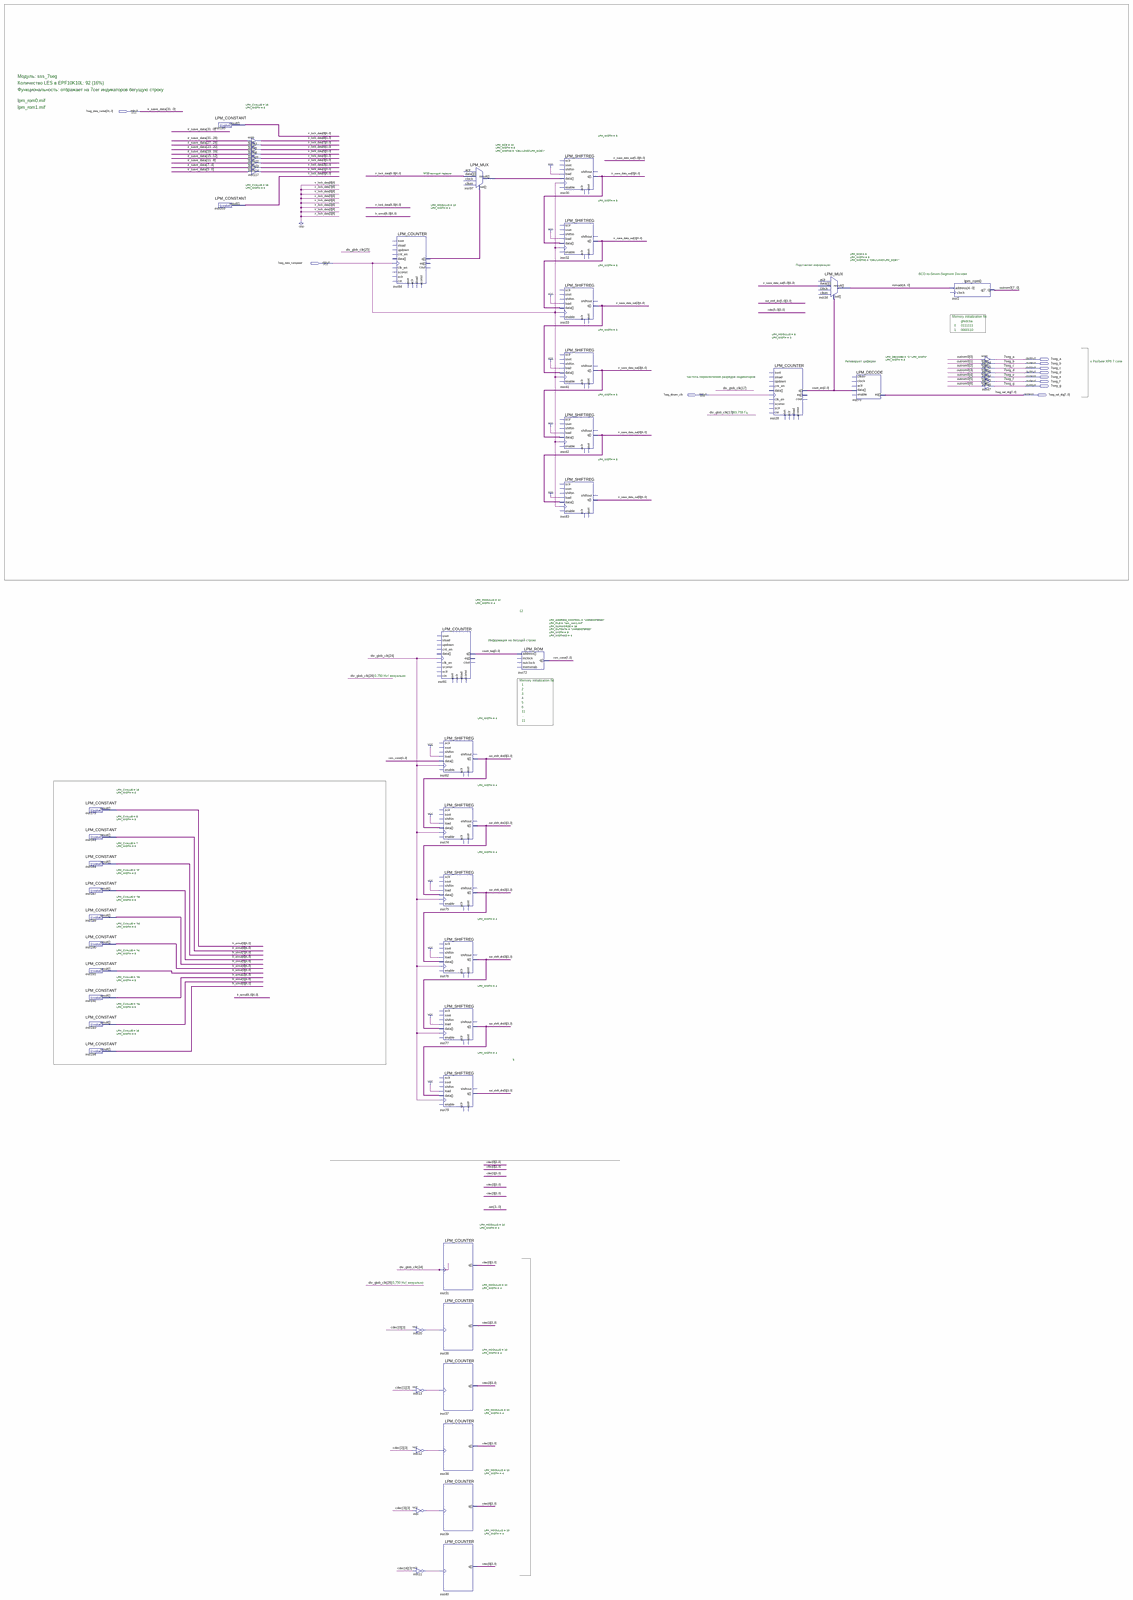
[diagram p0: schematic sheet, whole]
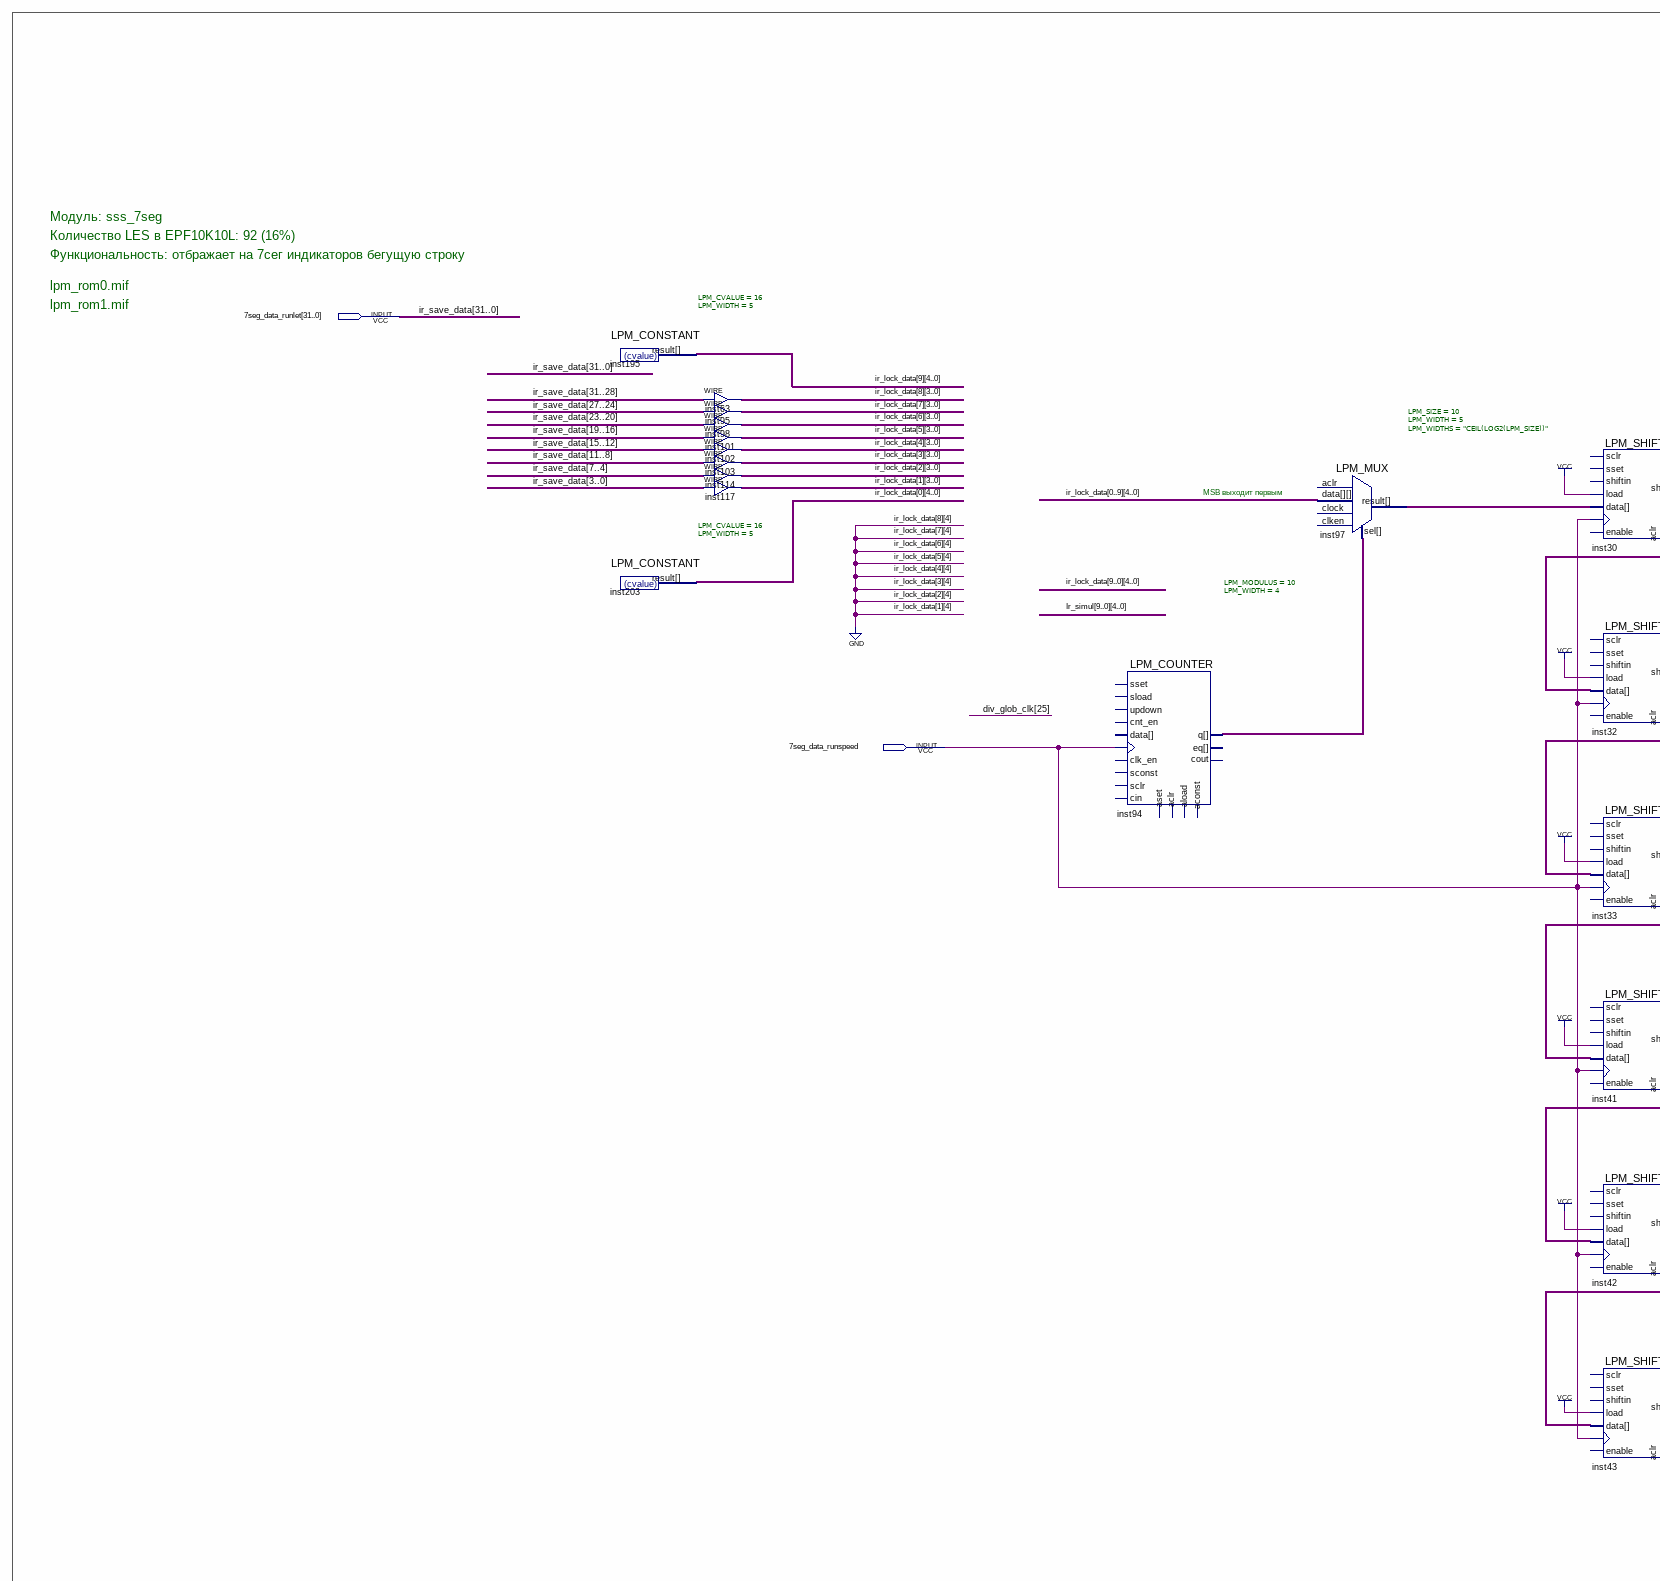
[diagram p1: schematic sheet, upper left part]
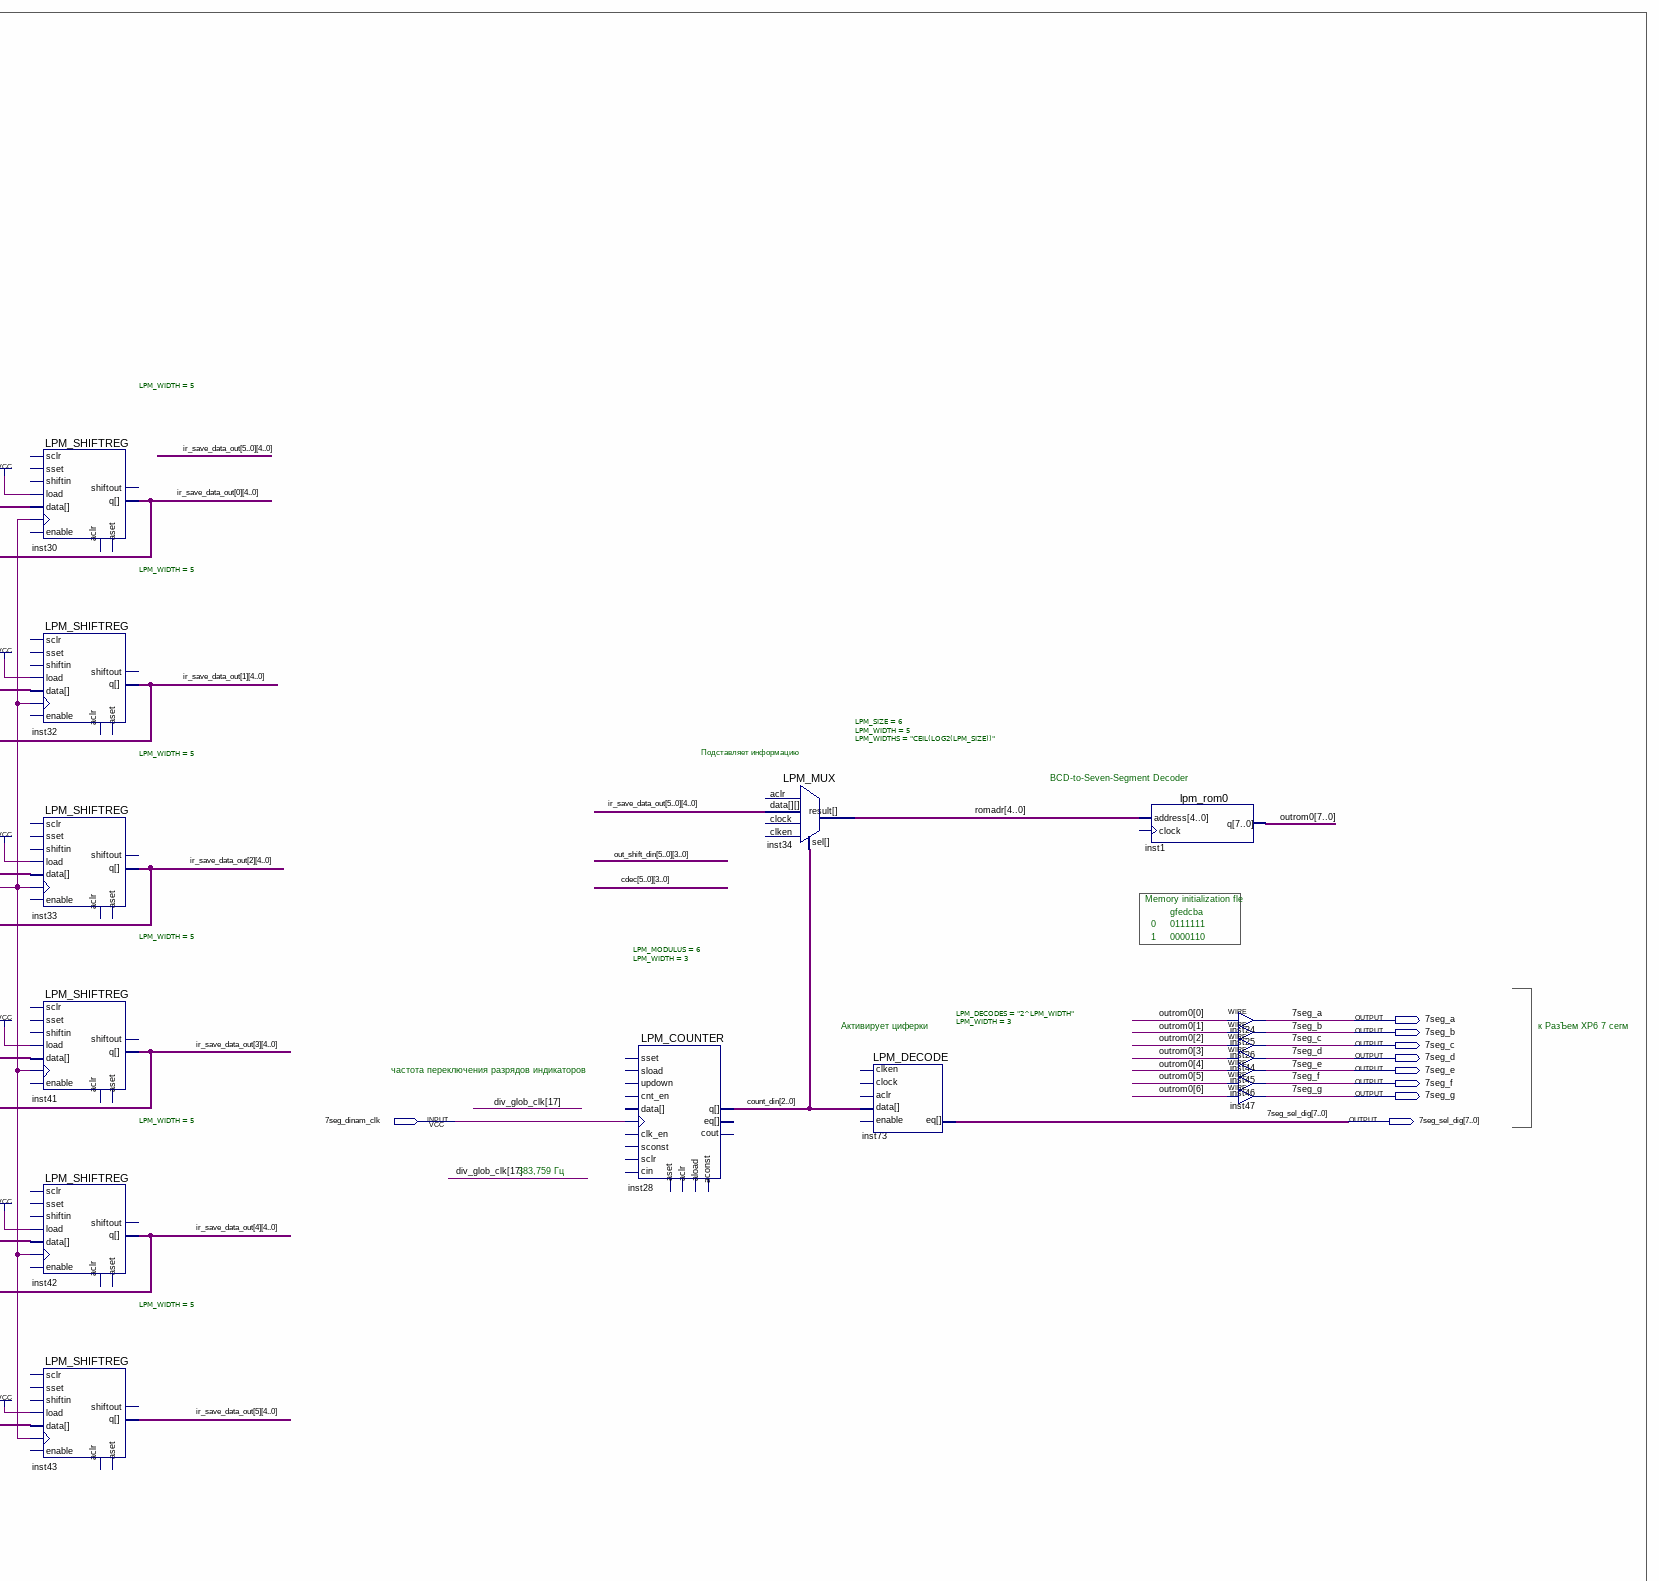
[diagram p2: schematic sheet, upper right part]
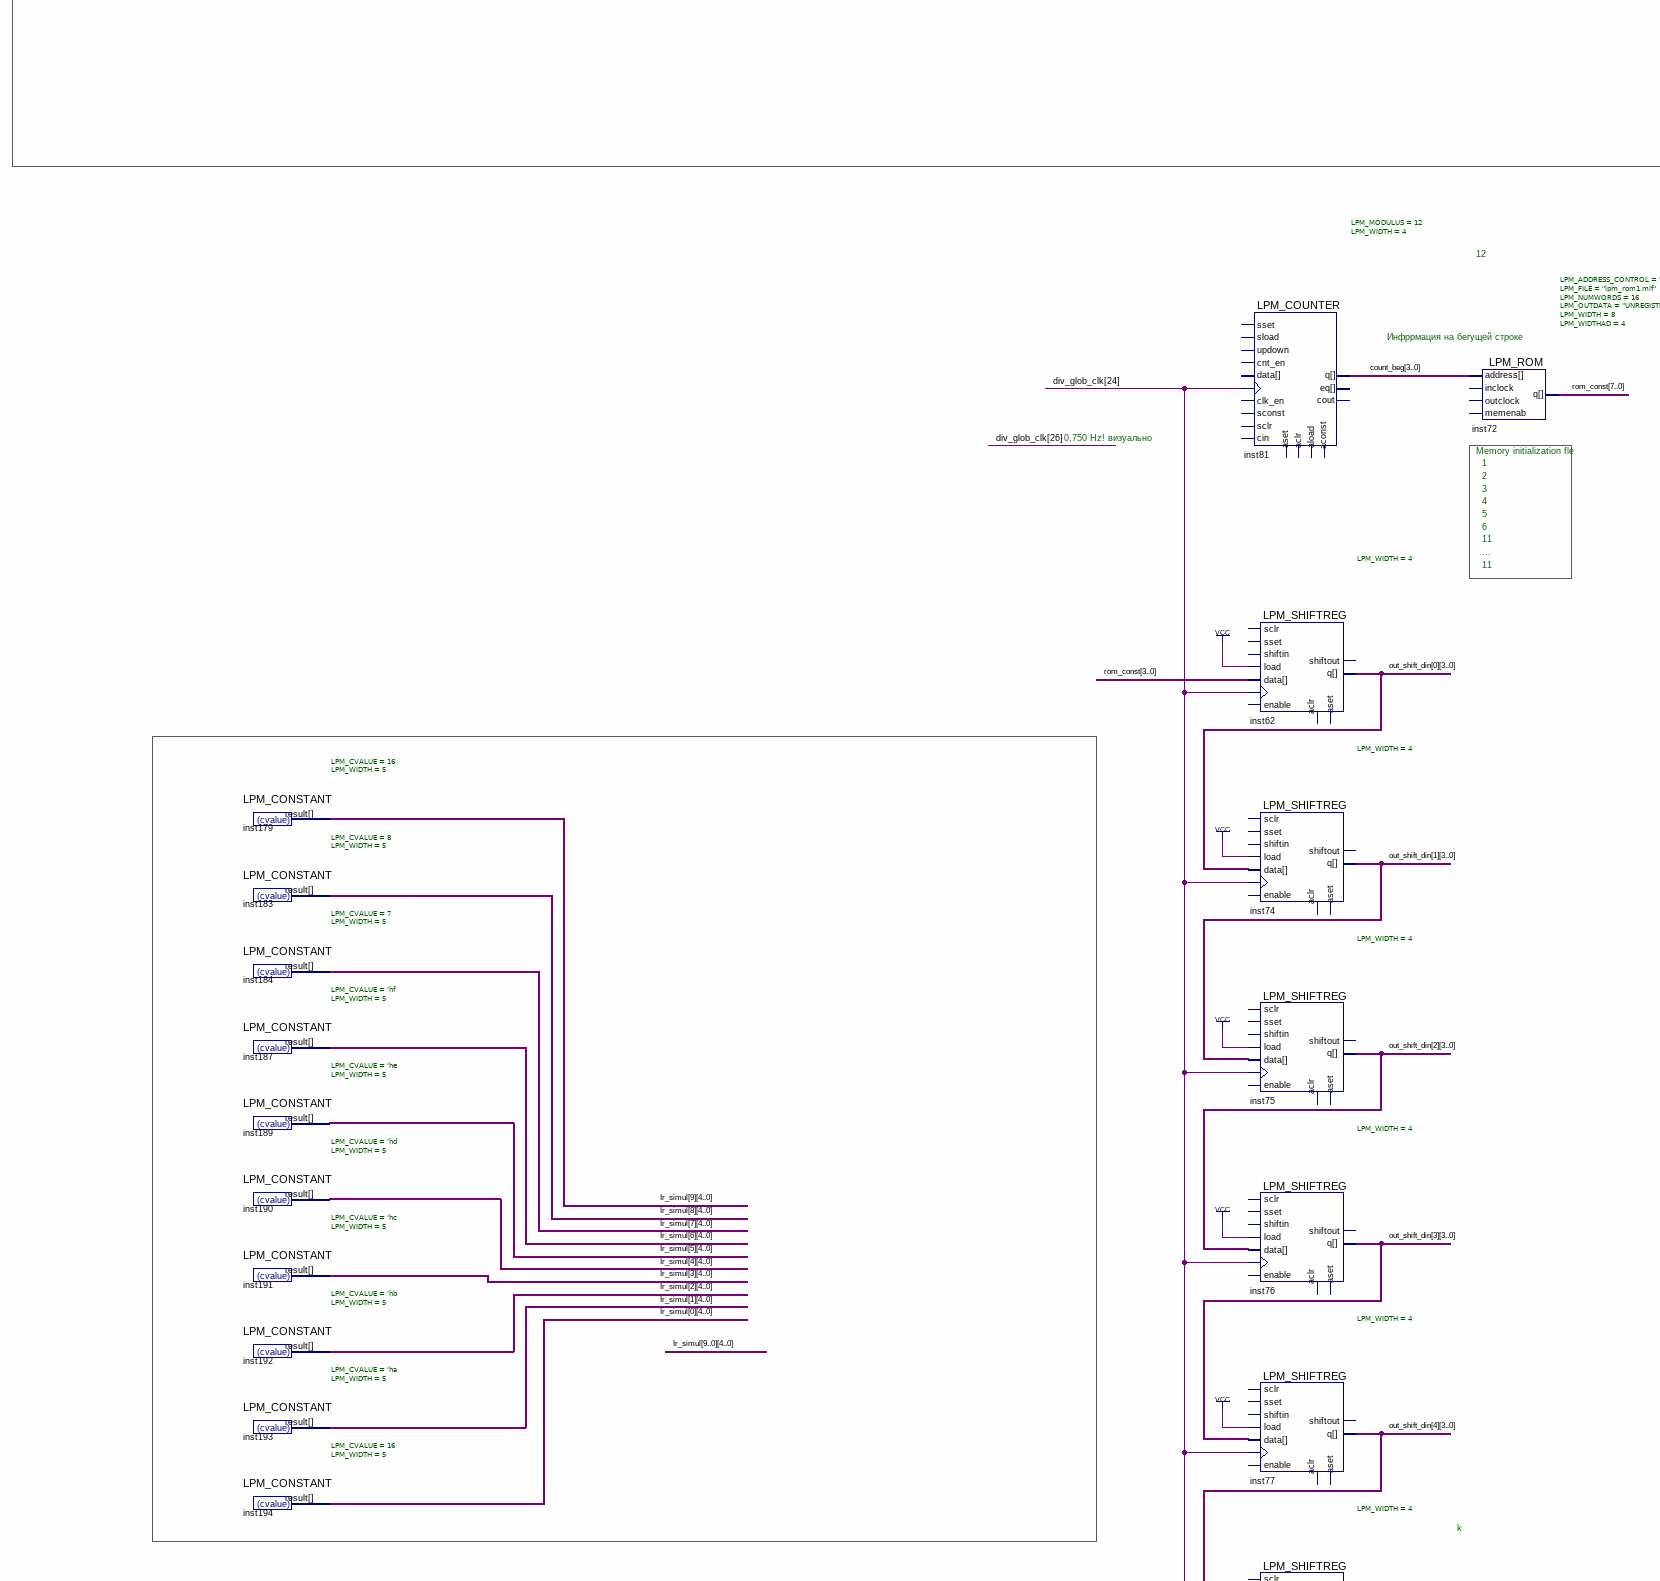
[diagram p3: schematic sheet, middle left part]
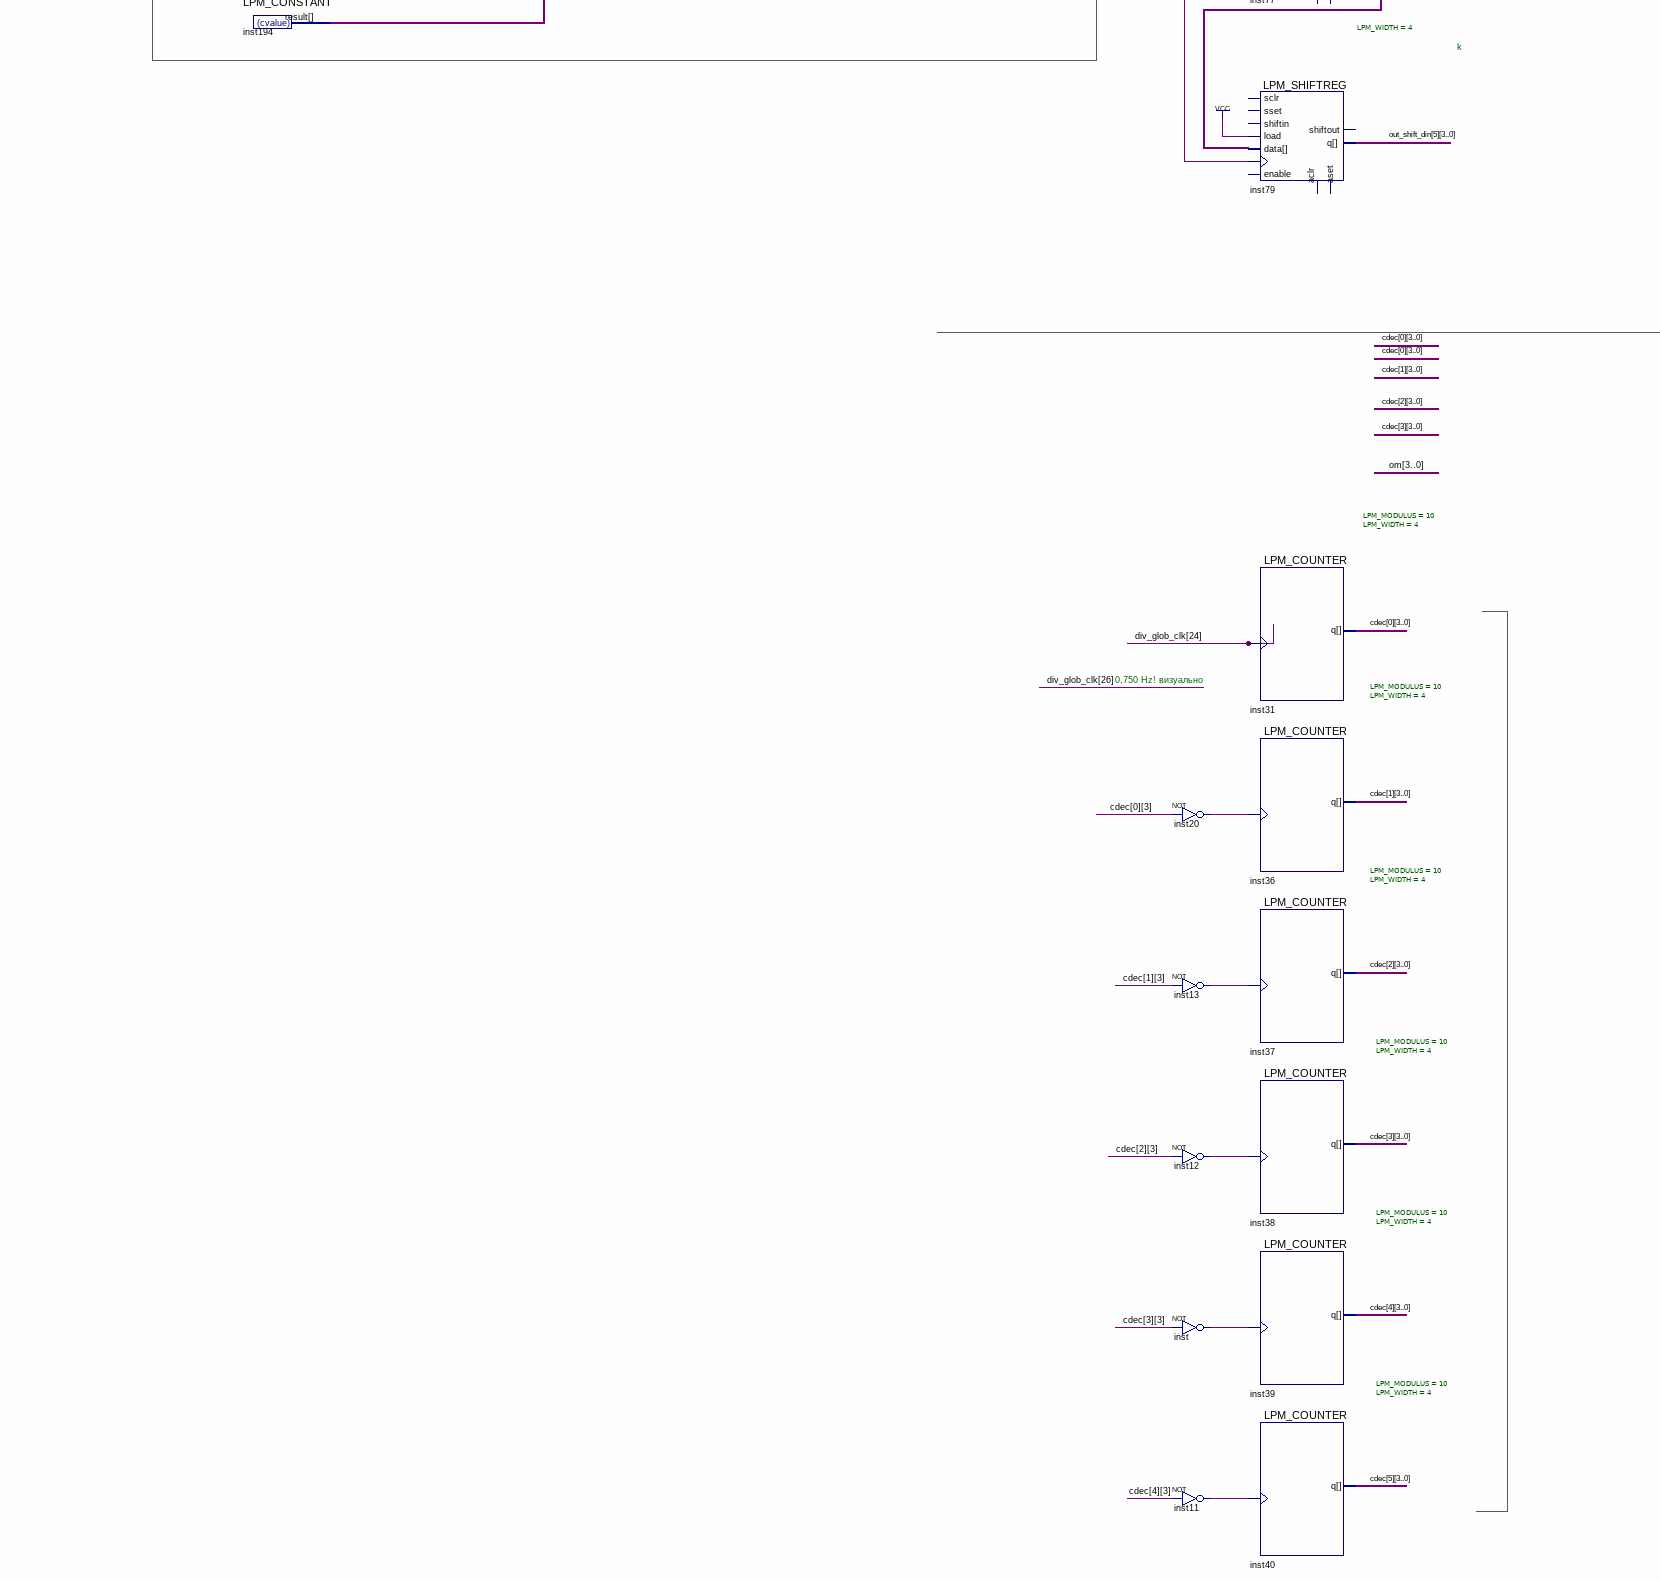
[diagram p4: schematic sheet, lower left part]
// Quartus schematic sss_7seg - Copy.bdf as structural Verilog: 58 symbols, 11 pins
module \sss_7seg_-_Copy  (
  input  [31:0] \7seg_data_runlet ,
  input  \7seg_data_runspeed ,
  input  \7seg_dinam_clk ,
  output \7seg_a ,
  output \7seg_b ,
  output \7seg_c ,
  output \7seg_d ,
  output \7seg_e ,
  output \7seg_f ,
  output \7seg_g ,
  output [7:0] \7seg_sel_dig 
);

  wire inst11_out, inst12_out, inst13_out, inst20_out, inst_out;
  wire [2:0] count_din;
  wire [3:0] cdec_0, cdec_1, cdec_2, cdec_3, cdec_4, cdec_5, count_beg, inst94_q, ir_lock_data_1,
       ir_lock_data_2, ir_lock_data_3, ir_lock_data_4, ir_lock_data_5, ir_lock_data_6, ir_lock_data_7,
       ir_lock_data_8, out_shift_din_0, out_shift_din_1, out_shift_din_2, out_shift_din_3, out_shift_din_4,
       out_shift_din_5;
  wire [4:0] inst97_result, ir_lock_data_0, ir_lock_data_9, ir_save_data_out_0, ir_save_data_out_1,
       ir_save_data_out_2, ir_save_data_out_3, ir_save_data_out_4, ir_save_data_out_5, Ir_simul_0,
       Ir_simul_1, Ir_simul_2, Ir_simul_3, Ir_simul_4, Ir_simul_5, Ir_simul_6, Ir_simul_7, Ir_simul_8,
       Ir_simul_9, romadr;
  wire [7:0] outrom0, rom_const;
  wire [24:24] div_glob_clk;

  LPM_CONSTANT #(.LPM_CVALUE(16), .LPM_WIDTH(5)) inst179 (.result(Ir_simul_9));
  LPM_CONSTANT #(.LPM_CVALUE(8), .LPM_WIDTH(5)) inst183 (.result(Ir_simul_8));
  LPM_CONSTANT #(.LPM_CVALUE(7), .LPM_WIDTH(5)) inst184 (.result(Ir_simul_7));
  LPM_CONSTANT #(.LPM_CVALUE('hf), .LPM_WIDTH(5)) inst187 (.result(Ir_simul_6));
  LPM_CONSTANT #(.LPM_CVALUE('he), .LPM_WIDTH(5)) inst189 (.result(Ir_simul_5));
  LPM_CONSTANT #(.LPM_CVALUE('hd), .LPM_WIDTH(5)) inst190 (.result(Ir_simul_4));
  LPM_CONSTANT #(.LPM_CVALUE('hc), .LPM_WIDTH(5)) inst191 (.result(Ir_simul_3));
  LPM_CONSTANT #(.LPM_CVALUE('hb), .LPM_WIDTH(5)) inst192 (.result(Ir_simul_2));
  LPM_CONSTANT #(.LPM_CVALUE('ha), .LPM_WIDTH(5)) inst193 (.result(Ir_simul_1));
  LPM_CONSTANT #(.LPM_CVALUE(16), .LPM_WIDTH(5)) inst194 (.result(Ir_simul_0));
  LPM_CONSTANT #(.LPM_CVALUE(16), .LPM_WIDTH(5)) inst195 (.result(ir_lock_data_9));
  LPM_CONSTANT #(.LPM_CVALUE(16), .LPM_WIDTH(5)) inst203 (.result(ir_lock_data_0));
  assign ir_lock_data_8 = \7seg_data_runlet [31:28];  // WIRE inst63
  assign ir_lock_data_7 = \7seg_data_runlet [27:24];  // WIRE inst95
  assign ir_lock_data_6 = \7seg_data_runlet [23:20];  // WIRE inst98
  assign ir_lock_data_5 = \7seg_data_runlet [19:16];  // WIRE inst101
  assign ir_lock_data_4 = \7seg_data_runlet [15:12];  // WIRE inst102
  assign ir_lock_data_3 = \7seg_data_runlet [11:8];  // WIRE inst103
  assign ir_lock_data_2 = \7seg_data_runlet [7:4];  // WIRE inst114
  assign ir_lock_data_1 = \7seg_data_runlet [3:0];  // WIRE inst117
  LPM_COUNTER #(.LPM_MODULUS(10), .LPM_WIDTH(4)) inst94 (
    .clock(\7seg_data_runspeed ), .q(inst94_q));  // open: sset, sload, updown, cnt_en, data, clk_en, sconst, sclr, aload, aclr, aset, aconst, cin, eq, cout
  not inst20 (inst20_out, cdec_0[3]);
  not inst13 (inst13_out, cdec_1[3]);
  not inst12 (inst12_out, cdec_2[3]);
  not inst (inst_out, cdec_3[3]);
  not inst11 (inst11_out, cdec_4[3]);
  LPM_COUNTER #(.LPM_MODULUS(12), .LPM_WIDTH(4)) inst81 (
    .clock(div_glob_clk[24]), .q(count_beg));  // open: sset, sload, updown, cnt_en, data, clk_en, sconst, sclr, aload, aclr, aset, aconst, cin, eq, cout
  LPM_SHIFTREG #(.LPM_WIDTH(4)) inst62 (
    .clock(div_glob_clk[24]), .data(rom_const[3:0]), .load(1'b1), .q(out_shift_din_0));  // open: shiftin, sset, enable, sclr, aset, aclr, shiftout
  LPM_SHIFTREG #(.LPM_WIDTH(4)) inst74 (
    .clock(div_glob_clk[24]), .data(out_shift_din_0), .load(1'b1), .q(out_shift_din_1));  // open: shiftin, sset, enable, sclr, aset, aclr, shiftout
  LPM_SHIFTREG #(.LPM_WIDTH(4)) inst75 (
    .clock(div_glob_clk[24]), .data(out_shift_din_1), .load(1'b1), .q(out_shift_din_2));  // open: shiftin, sset, enable, sclr, aset, aclr, shiftout
  LPM_SHIFTREG #(.LPM_WIDTH(4)) inst76 (
    .clock(div_glob_clk[24]), .data(out_shift_din_2), .load(1'b1), .q(out_shift_din_3));  // open: shiftin, sset, enable, sclr, aset, aclr, shiftout
  LPM_SHIFTREG #(.LPM_WIDTH(4)) inst77 (
    .clock(div_glob_clk[24]), .data(out_shift_din_3), .load(1'b1), .q(out_shift_din_4));  // open: shiftin, sset, enable, sclr, aset, aclr, shiftout
  LPM_SHIFTREG #(.LPM_WIDTH(4)) inst79 (
    .clock(div_glob_clk[24]), .data(out_shift_din_4), .load(1'b1), .q(out_shift_din_5));  // open: shiftin, sset, enable, sclr, aset, aclr, shiftout
  LPM_COUNTER #(.LPM_MODULUS(10), .LPM_WIDTH(4)) inst31 (.clock(div_glob_clk[24]), .q(cdec_0));
  LPM_COUNTER #(.LPM_MODULUS(10), .LPM_WIDTH(4)) inst36 (.clock(inst20_out), .q(cdec_1));
  LPM_COUNTER #(.LPM_MODULUS(10), .LPM_WIDTH(4)) inst37 (.clock(inst13_out), .q(cdec_2));
  LPM_COUNTER #(.LPM_MODULUS(10), .LPM_WIDTH(4)) inst38 (.clock(inst12_out), .q(cdec_3));
  LPM_COUNTER #(.LPM_MODULUS(10), .LPM_WIDTH(4)) inst39 (.clock(inst_out), .q(cdec_4));
  LPM_COUNTER #(.LPM_MODULUS(10), .LPM_WIDTH(4)) inst40 (.clock(inst11_out), .q(cdec_5));
  LPM_MUX #(.LPM_SIZE(10), .LPM_WIDTH(5), .LPM_WIDTHS("CEIL(LOG2(LPM_SIZE))")) inst97 (
    .data({ir_lock_data_0, 1'b0, ir_lock_data_1, 1'b0, ir_lock_data_2, 1'b0, ir_lock_data_3, 1'b0, ir_lock_data_4, 1'b0, ir_lock_data_5, 1'b0, ir_lock_data_6, 1'b0, ir_lock_data_7, 1'b0, ir_lock_data_8, ir_lock_data_9}),
    .sel(inst94_q), .result(inst97_result));  // open: clock, aclr, clken
  LPM_ROM #(.LPM_ADDRESS_CONTROL("UNREGISTERED"), .LPM_FILE("lpm_rom1.mif"), .LPM_NUMWORDS(16), .LPM_OUTDATA("UNREGISTERED"), .LPM_WIDTH(8), .LPM_WIDTHAD(4)) inst72 (
    .address(count_beg), .q(rom_const));  // open: inclock, outclock, memenab
  LPM_SHIFTREG #(.LPM_WIDTH(5)) inst30 (
    .clock(\7seg_data_runspeed ), .data(inst97_result), .load(1'b1), .q(ir_save_data_out_0));  // open: shiftin, sset, enable, sclr, aset, aclr, shiftout
  LPM_SHIFTREG #(.LPM_WIDTH(5)) inst32 (
    .clock(\7seg_data_runspeed ), .data(ir_save_data_out_0), .load(1'b1), .q(ir_save_data_out_1));  // open: shiftin, sset, enable, sclr, aset, aclr, shiftout
  LPM_SHIFTREG #(.LPM_WIDTH(5)) inst33 (
    .clock(\7seg_data_runspeed ), .data(ir_save_data_out_1), .load(1'b1), .q(ir_save_data_out_2));  // open: shiftin, sset, enable, sclr, aset, aclr, shiftout
  LPM_SHIFTREG #(.LPM_WIDTH(5)) inst41 (
    .clock(\7seg_data_runspeed ), .data(ir_save_data_out_2), .load(1'b1), .q(ir_save_data_out_3));  // open: shiftin, sset, enable, sclr, aset, aclr, shiftout
  LPM_SHIFTREG #(.LPM_WIDTH(5)) inst42 (
    .clock(\7seg_data_runspeed ), .data(ir_save_data_out_3), .load(1'b1), .q(ir_save_data_out_4));  // open: shiftin, sset, enable, sclr, aset, aclr, shiftout
  LPM_SHIFTREG #(.LPM_WIDTH(5)) inst43 (
    .clock(\7seg_data_runspeed ), .data(ir_save_data_out_4), .load(1'b1), .q(ir_save_data_out_5));  // open: shiftin, sset, enable, sclr, aset, aclr, shiftout
  LPM_COUNTER #(.LPM_MODULUS(6), .LPM_WIDTH(3)) inst28 (
    .clock(\7seg_dinam_clk ), .q(count_din));  // open: sset, sload, updown, cnt_en, data, clk_en, sconst, sclr, aload, aclr, aset, aconst, cin, eq, cout
  LPM_MUX #(.LPM_SIZE(6), .LPM_WIDTH(5), .LPM_WIDTHS("CEIL(LOG2(LPM_SIZE))")) inst34 (
    .data({ir_save_data_out_5, ir_save_data_out_4, ir_save_data_out_3, ir_save_data_out_2, ir_save_data_out_1, ir_save_data_out_0}),
    .sel(count_din), .result(romadr));  // open: clock, aclr, clken
  LPM_DECODE #(.LPM_DECODES("2^LPM_WIDTH"), .LPM_WIDTH(3)) inst73 (
    .data(count_din), .eq(\7seg_sel_dig ));  // open: enable, clken, clock, aclr
  lpm_rom0 inst1 (.address(romadr), .q(outrom0));  // open: clock
  assign \7seg_a  = outrom0[0];  // WIRE inst24
  assign \7seg_b  = outrom0[1];  // WIRE inst25
  assign \7seg_c  = outrom0[2];  // WIRE inst26
  assign \7seg_d  = outrom0[3];  // WIRE inst44
  assign \7seg_e  = outrom0[4];  // WIRE inst45
  assign \7seg_f  = outrom0[5];  // WIRE inst46
  assign \7seg_g  = outrom0[6];  // WIRE inst47

  // Other names for the same wires on the sheet: ir_save_data[31:0] = \7seg_data_runlet 

  // Notes on the sheet:
  //   Модуль: sss_7seg
  //   Количество LES в EPF10K10L: 92 (16%)
  //   Функциональность: отбражает на 7сег индикаторов бегущую строку
  //   lpm_rom0.mif
  //   lpm_rom1.mif
  //   MSB выходит первым
  //   Подставляет информацию
  //   BCD-to-Seven-Segment Decoder
  //   Memory initialization fle
  //   gfedcba
  //   0
  //   0111111
  //   1
  //   0000110
  //   Активирует циферки
  //   к РазЪем XP6 7 сегм
  //   частота переключения разрядов индикаторов
  //   383,759 Гц
  //   12
  //   Инфррмация на бегущей строке
  //   0,750 Hz! визуально
  //   Memory initialization fle
  //   1
  //   2
  //   3
  //   4
  //   5
  //   6
  //   11
  //   ...
  //   11
  //   k
  //   0,750 Hz! визуально
endmodule
